# EAGLE schematic VoiceRecognitionGroup3 (EAGLE 9.2.1)
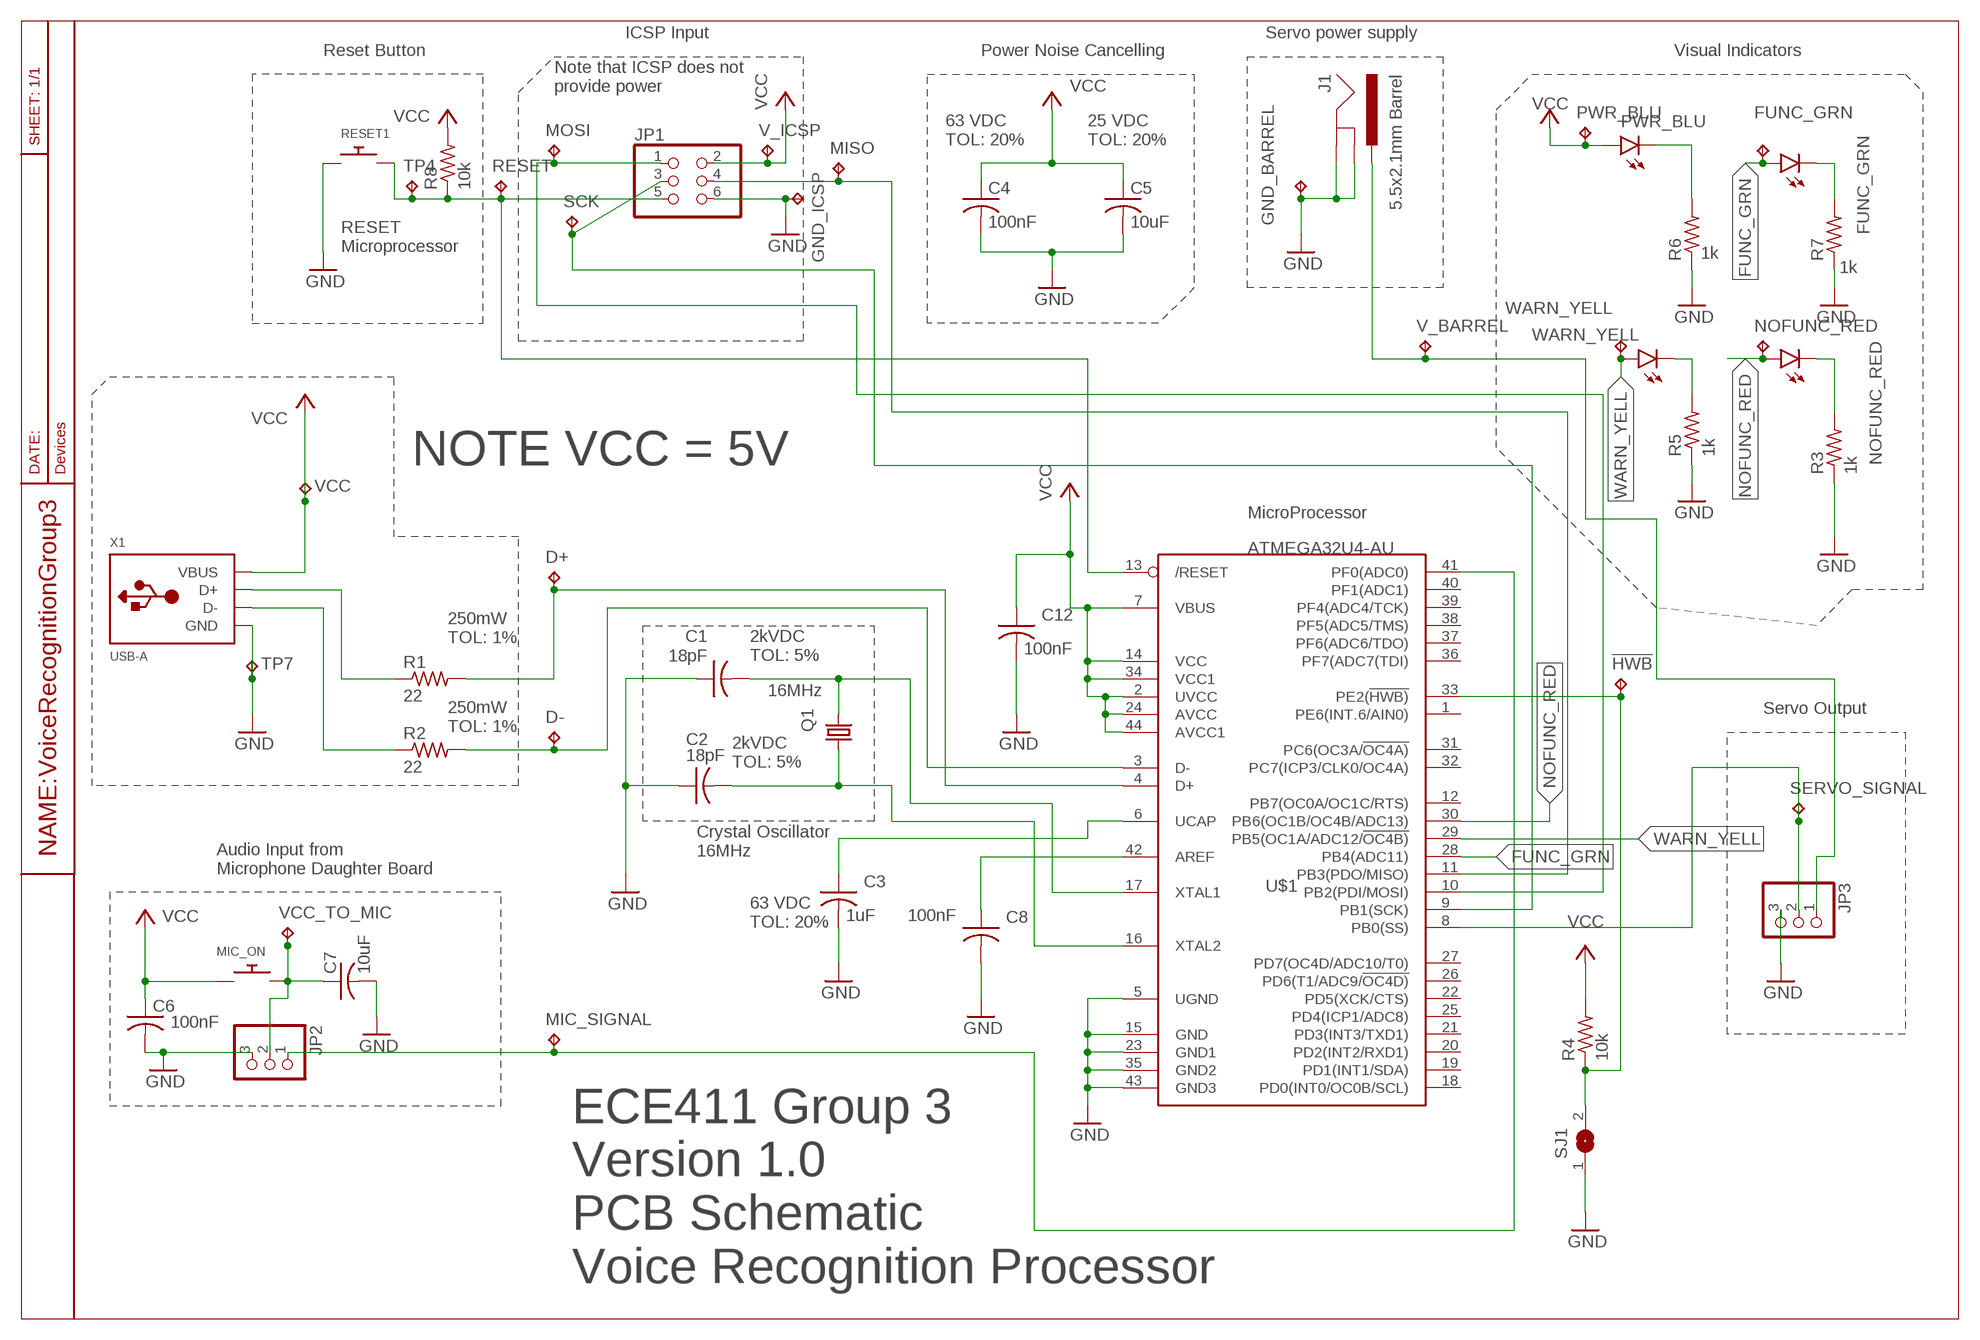
[diagram p0: schematic, sheet 1]

## Parts
!HWB  TPTP15SQ  [TP15SQ]
C1  18pF  C-USC1206  [C1206]
C2  18pF  C-USC1206  [C1206]
C3  1uF  C-USC1206  [C1206]
C4  100nF  C-USC1206  [C1206]
C5  10uF  C-USC1206  [C1206]
C6  100nF  C-USC1206  [C1206]
C7  10uF  C-USC1206  [C1206]
C8  100nF  C-USC1206  [C1206]
C12  100nF  C-USC1206  [C1206]
D+  TPTP15SQ  [TP15SQ]
D-  TPTP15SQ  [TP15SQ]
FUNC_GRN  TPTP15SQ  [TP15SQ]
GND_BARREL  TPTP15SQ  [TP15SQ]
GND_ICSP  TPTP15SQ  [TP15SQ]
J1  5.5x2.1mm Barrel  POWER_JACKSMD  [POWER_JACK_SMD]
JP1  PINHD-2X3  [2X03]
JP2  PINHD-1X3  [1X03]
JP3  PINHD-1X3  [1X03]
LED2  LEDSMT1206  [1206]
LED3  LEDSMT1206  [1206]
LED4  LEDSMT1206  [1206]
MIC_ON  SWITCH_PUSHBUTTONC&K_KSS  [BTN_CK_KSS]
MIC_SIGNAL  TPTP15SQ  [TP15SQ]
MISO  TPTP15SQ  [TP15SQ]
MOSI  TPTP15SQ  [TP15SQ]
NOFUNC_RED  TPTP15SQ  [TP15SQ]
PWR-BLU  LEDSMT1206  [1206]
PWR_BLU  TPTP15SQ  [TP15SQ]
Q1  16MHz  CRYSTALCTS406  [CTS406]
R1  22  R-US_M1206  [M1206]
R2  22  R-US_M1206  [M1206]
R3  1k  R-US_M1206  [M1206]
R4  10k  R-US_M1206  [M1206]
R5  1k  R-US_M1206  [M1206]
R6  1k  R-US_M1206  [M1206]
R7  1k  R-US_M1206  [M1206]
R8  10k  R-US_M1206  [M1206]
RESET  TPTP15SQ  [TP15SQ]
RESET1  SWITCH_PUSHBUTTONC&K_KSS  [BTN_CK_KSS]
SCK  TPTP15SQ  [TP15SQ]
SERVO_SIGNAL  TPTP15SQ  [TP15SQ]
SJ1  SJW  [SJW]
TP4  TPTP15SQ  [TP15SQ]
TP7  TPTP15SQ  [TP15SQ]
U$1  ATMEGA32U4-AU  [TQFP44]
V_BARREL  TPTP15SQ  [TP15SQ]
V_ICSP  TPTP15SQ  [TP15SQ]
VCC  TPTP15SQ  [TP15SQ]
VCC_TO_MIC  TPTP15SQ  [TP15SQ]
WARN_YELL  TPTP15SQ  [TP15SQ]
X1  USB-A  [MOLEX_480371000]

## Nets
FUNC_GRN: FUNC_GRN.TP LED2.A U$1.28(PB4(ADC11))
GND: C1.1 C2.1 C3.2 C4.2 C5.2 C6.2 C7.2 C8.2 C12.2 GND_BARREL.TP GND_ICSP.TP J1.GND(GNDBREAK) J1.P$4(GND) JP1.6 JP2.3 JP3.3 R3.1 R5.1 R6.1 R7.1 RESET1.P$1 SJ1.1 TP7.TP U$1.5(UGND) U$1.15(GND) U$1.23(GND1) U$1.35(GND2) U$1.43(GND3) X1.4(GND)
HWB: !HWB.TP R4.1 SJ1.2 U$1.33(PE2(!HWB))
MIC_SIGNAL: JP2.1 MIC_SIGNAL.TP U$1.41(PF0(ADC0))
N$1: C3.1 U$1.6(UCAP)
N$2: JP1.3 SCK.TP U$1.9(PB1(SCK))
N$3: R1.1 X1.3(D+)
N$5: PWR-BLU.C R6.2
N$6: LED2.C R7.2
N$7: LED4.C R5.2
N$8: LED3.C R3.2
N$9: R2.1 X1.2(D-)
N$12: D+.TP R1.2 U$1.4(D+)
N$13: JP1.1 MOSI.TP U$1.10(PB2(PDI/MOSI))
N$14: C8.1 U$1.42(AREF)
N$15: C7.1 JP2.2 MIC_ON.P$2 VCC_TO_MIC.TP
N$16: C1.2 Q1.3 U$1.17(XTAL1)
N$17: JP1.4 MISO.TP U$1.11(PB3(PDO/MISO))
N$20: D-.TP R2.2 U$1.3(D-)
N$22: C2.2 Q1.1 U$1.16(XTAL2)
NOFUNC_RED: LED3.A NOFUNC_RED.TP U$1.30(PB6(OC1B/OC4B/ADC13))
RST: JP1.5 R8.1 RESET1.P$2 RESET.TP TP4.TP U$1.13(/RESET)
SERVO_POS: J1.VIN0(PWR) JP3.1 V_BARREL.TP
SIGNAL: JP3.2 SERVO_SIGNAL.TP U$1.8(PB0(SS))
VCC: C4.1 C5.1 C6.1 C12.1 JP1.2 MIC_ON.P$1 PWR-BLU.A PWR_BLU.TP R4.2 R8.2 U$1.2(UVCC) U$1.7(VBUS) U$1.14(VCC) U$1.24(AVCC) U$1.34(VCC1) U$1.44(AVCC1) V_ICSP.TP VCC.TP X1.1(VBUS)
WARN_YELL: LED4.A U$1.29(PB5(OC1A/ADC12/!OC4B)) WARN_YELL.TP
Unconnected: U$1.1(PE6(INT.6/AIN0)) U$1.12(PB7(OC0A/OC1C/RTS)) U$1.18(PD0(INT0/OC0B/SCL)) U$1.19(PD1(INT1/SDA)) U$1.20(PD2(INT2/RXD1)) U$1.21(PD3(INT3/TXD1)) U$1.22(PD5(XCK/CTS)) U$1.25(PD4(ICP1/ADC8)) U$1.26(PD6(T1/ADC9/!OC4D)) U$1.27(PD7(OC4D/ADC10/T0)) U$1.31(PC6(OC3A/!OC4A)) U$1.32(PC7(ICP3/CLK0/OC4A)) U$1.36(PF7(ADC7(TDI)) U$1.37(PF6(ADC6/TDO)) U$1.38(PF5(ADC5/TMS)) U$1.39(PF4(ADC4/TCK)) U$1.40(PF1(ADC1))

## Notes on the sheet
- ICSP Input | Servo power supply
- Reset Button | Power Noise Cancelling | Visual Indicators
- Note that ICSP does not
  provide power
- PWR_BLU
- 63 VDC
  TOL: 20%
- 25 VDC
  TOL: 20%
- RESET 
  Microprocessor
- WARN_YELL
- NOTE VCC = 5V
- MicroProcessor
- 250mW
  TOL: 1%
- 2kVDC
  TOL: 5%
- Servo Output
- 250mW
  TOL: 1%
- 2kVDC
  TOL: 5%
- Crystal Oscillator
  16MHz
- Audio Input from 
  Microphone Daughter Board
- 63 VDC
  TOL: 20%
- ECE411 Group 3
  Version 1.0
  PCB Schematic
  Voice Recognition Processor

## Library data of the parts
!HWB D+ D- FUNC_GRN GND_BARREL GND_ICSP MIC_SIGNAL MISO MOSI NOFUNC_RED PWR_BLU RESET SCK SERVO_SIGNAL TP4 TP7 V_BARREL V_ICSP VCC VCC_TO_MIC WARN_YELL = testpad:TP: Test pad
C1-C8 C12 = rcl:C-US: CAPACITOR, American symbol; SPICEPREFIX: C
J1 = SparkFun-Connectors:POWER_JACK: Power Jack Connector This is the standard 5.5mm barrel jack for power. The PTH is the most common, proven, reliable, footprint. The Slot footprint only works if the mill layer is transmitted to the PCB fab house so be warned. Here are the connectors we sell at SparkFun: DC Barrel Power Jack/Connector <https://www.sparkfun.com/products/119> (PRT-00119) DC Barrel Power Jack/Connector (SMD) <https://www.sparkfun.com/products/12748> (PRT-12748) DC Barrel Jack Adapter - Breadboard Compatible <https://www.sparkfun.com/products/10811> (PRT-10811) It is used on this SparkFun product (and many, many others): SparkFun RedBoard - Programmed with Arduino <https://www.sparkfun.com/products/12757> (DEV-12757) Also, if you need a mating power supply or connector, please check these out: Wall Adapter Power Supply - 9VDC 650mA <https://www.sparkfun.com/products/298> (TOL-00298) DC Barrel Jack Adapter - Male <https://www.sparkfun.com/products/10287> (PRT-10287); PROD_ID: CONN-08106; SF_ID: PRT-12748
JP1 = pinhead:PINHD-2X3: PIN HEADER
JP2 JP3 = pinhead:PINHD-1X3: PIN HEADER
LED2-LED4 PWR-BLU = led:LED: LED OSRAM: - CHIPLED LG R971, LG N971, LY N971, LG Q971, LY Q971, LO R971, LY R971 LH N974, LH R974 LS Q976, LO Q976, LY Q976 LO Q996 - Hyper CHIPLED LW Q18S LB Q993, LB Q99A, LB R99A - SideLED LS A670, LO A670, LY A670, LG A670, LP A670 LB A673, LV A673, LT A673, LW A673 LH A674 LY A675 LS A676, LA A676, LO A676, LY A676, LW A676 LS A679, LY A679, LG A679 - Hyper Micro SIDELED® LS Y876, LA Y876, LO Y876, LY Y876 LT Y87S - SmartLED LW L88C, LW L88S LB L89C, LB L89S, LG L890 LS L89K, LO L89K, LY L89K LS L896, LA L896, LO L896, LY L896 - TOPLED LS T670, LO T670, LY T670, LG T670, LP T670 LSG T670, LSP T670, LSY T670, LOP T670, LYG T670 LG T671, LOG T671, LSG T671 LB T673, LV T673, LT T673, LW T673 LH T674 LS T676, LA T676, LO T676, LY T676, LB T676, LH T676, LSB T676, LW T676 LB T67C, LV T67C, LT T67C, LS T67K, LO T67K, LY T67K, LW E67C LS E67B, LA E67B, LO E67B, LY E67B, LB E67C, LV E67C, LT E67C LW T67C LS T679, LY T679, LG T679 LS T770, LO T770, LY T770, LG T770, LP T770 LB T773, LV T773, LT T773, LW T773 LH T774 LS E675, LA E675, LY E675, LS T675 LS T776, LA T776, LO T776, LY T776, LB T776 LHGB T686 LT T68C, LB T68C - Hyper Mini TOPLED® LB M676 - Mini TOPLED Santana® LG M470 LS M47K, LO M47K, LY M47K Source: http://www.osram.convergy.de LUXEON: - LUMILED® LXK2-PW12-R00, LXK2-PW12-S00, LXK2-PW14-U00, LXK2-PW14-V00 LXK2-PM12-R00, LXK2-PM12-S00, LXK2-PM14-U00 LXK2-PE12-Q00, LXK2-PE12-R00, LXK2-PE12-S00, LXK2-PE14-T00, LXK2-PE14-U00 LXK2-PB12-K00, LXK2-PB12-L00, LXK2-PB12-M00, LXK2-PB14-N00, LXK2-PB14-P00, LXK2-PB14-Q00 LXK2-PR12-L00, LXK2-PR12-M00, LXK2-PR14-Q00, LXK2-PR14-R00 LXK2-PD12-Q00, LXK2-PD12-R00, LXK2-PD12-S00 LXK2-PH12-R00, LXK2-PH12-S00 LXK2-PL12-P00, LXK2-PL12-Q00, LXK2-PL12-R00 Source: www.luxeon.com KINGBRIGHT: KA-3528ASYC Source: www.kingbright.com
MIC_ON RESET1 = adafruit:SWITCH_PUSHBUTTON: Buttons SOFTTOUCHSMD_SJ - Soft touch temporary push button (Super Junk Akihabara) Compatible with SKPMANE010 [Mouser: 688-SKPMAN] C&K_KSS = Digikey: KSS221GLFS
Q1 = adafruit:CRYSTAL: CRYSTAL; OC_FARNELL: unknown; OC_NEWARK: unknown
R1-R8 = rcl:R-US_: RESISTOR, American symbol; SPICEPREFIX: R
SJ1 = jumper:SJ: SMD solder JUMPER
U$1 = adafruit:ATMEGA32U4: http://www.ladyada.net/library/eagle
X1 = adafruit:USB-A: USB type A 'plug' Used for things that can directly connect to a USB port, say USB key